# Altium schematic sheet USB2514 MCU.SchDoc: asdasdasd
size A4; DocumentNumber: 2; SheetNumber: 2; SheetTotal: 6
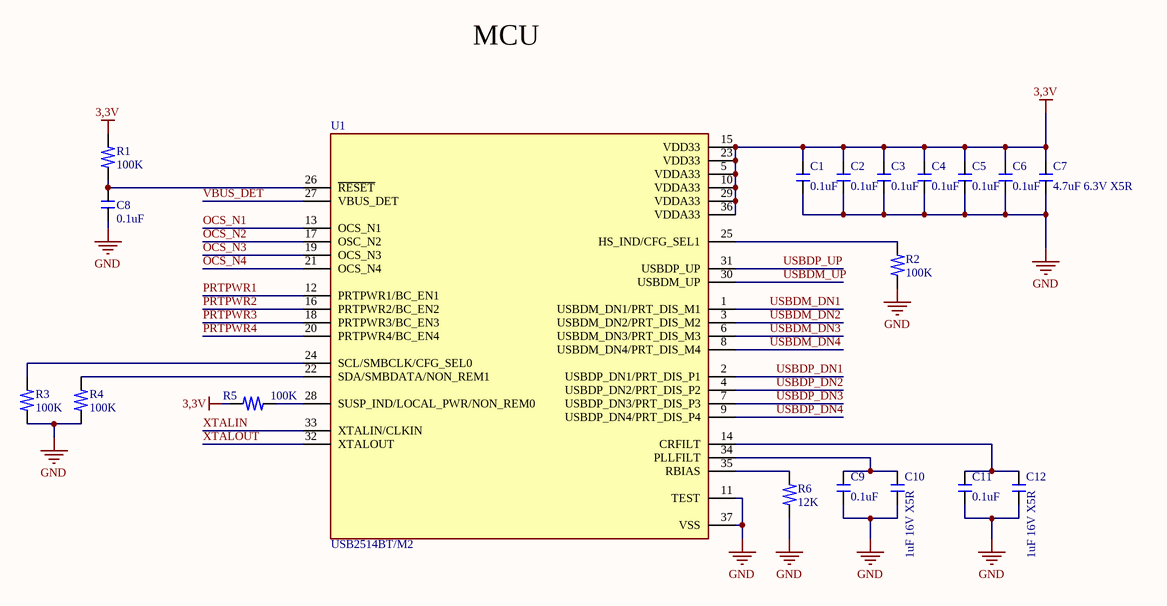
[diagram p0: USB2514 MCU.SchDoc]

## Parts
C1  0.1uF  [CAPC1608X06N-0603]
C2  0.1uF  [CAPC1608X06N-0603]
C3  0.1uF  [CAPC1608X06N-0603]
C4  0.1uF  [CAPC1608X06N-0603]
C5  0.1uF  [CAPC1608X06N-0603]
C6  0.1uF  [CAPC1608X06N-0603]
C7  4.7uF 6.3V X5R  [CAPC1608X06N-0603]
C8  0.1uF  [CAPC1608X06N-0603]
C9  0.1uF  [CAPC1608X06N-0603]
C10  1uF 16V X5R  [CAPC1608X06N-0603]
C11  0.1uF  [CAPC1608X06N-0603]
C12  1uF 16V X5R  [CAPC1608X06N-0603]
R1  100K  [RESC1608X06N-0603]
R2  100K  [RESC1608X06N-0603]
R3  100K  [RESC1608X06N-0603]
R4  100K  [RESC1608X06N-0603]
R5  100K  [RESC1608X06N-0603]
R6  12K  [RESC1608X06N-0603]
U1  USB2514BT/M2  [QFN50P600X600X100_HS-37N]

## Nets
3,3V: C1.2 C2.2 C3.2 C4.2 C5.2 C6.2 C7.2 R1.2 R5.2 U1.5(VDDA33) U1.10(VDDA33) U1.15(VDD33) U1.23(VDD33) U1.29(VDDA33) U1.36(VDDA33)
GND: C1.1 C2.1 C3.1 C4.1 C5.1 C6.1 C7.1 C8.1 C9.1 C10.1 C11.1 C12.1 R2.1 R3.1 R4.1 R6.1 U1.11(TEST) U1.37(VSS)
OCS_N1: U1.13(OCS_N1)
OCS_N2: U1.17(OSC_N2)
OCS_N3: U1.19(OCS_N3)
OCS_N4: U1.21(OCS_N4)
PRTPWR1: U1.12(PRTPWR1/BC_EN1)
PRTPWR2: U1.16(PRTPWR2/BC_EN2)
PRTPWR3: U1.18(PRTPWR3/BC_EN3)
PRTPWR4: U1.20(PRTPWR4/BC_EN4)
USBDM_DN1: U1.1(USBDM_DN1/PRT_DIS_M1)
USBDM_DN2: U1.3(USBDM_DN2/PRT_DIS_M2)
USBDM_DN3: U1.6(USBDM_DN3/PRT_DIS_M3)
USBDM_DN4: U1.8(USBDM_DN4/PRT_DIS_M4)
USBDM_UP: U1.30(USBDM_UP)
USBDP_DN1: U1.2(USBDP_DN1/PRT_DIS_P1)
USBDP_DN2: U1.4(USBDP_DN2/PRT_DIS_P2)
USBDP_DN3: U1.7(USBDP_DN3/PRT_DIS_P3)
USBDP_DN4: U1.9(USBDP_DN4/PRT_DIS_P4)
USBDP_UP: U1.31(USBDP_UP)
VBUS_DET: U1.27(VBUS_DET)
XTALIN: U1.33(XTALIN/CLKIN)
XTALOUT: U1.32(XTALOUT)
NetC8_2: C8.2 R1.1 U1.26(~{RESET})
NetC9_2: C9.2 C10.2 U1.34(PLLFILT)
NetC11_2: C11.2 C12.2 U1.14(CRFILT)
NetR2_2: R2.2 U1.25(HS_IND/CFG_SEL1)
NetR3_2: R3.2 U1.24(SCL/SMBCLK/CFG_SEL0)
NetR4_2: R4.2 U1.22(SDA/SMBDATA/NON_REM1)
NetR5_1: R5.1 U1.28(SUSP_IND/LOCAL_PWR/NON_REM0)
NetR6_2: R6.2 U1.35(RBIAS)

## Notes on the sheet
- MCU

## Library data of the parts
C1-C12 = CAP_0603_0.1uF
R1-R6 = RES_0603_10K
U1 = USB2514BT/M2: USB Hub Controller USB Interface 36-SQFN (6x6); MF: Microchip; Purchase-URL: https://pricing.snapeda.com/search/part/USB2514BT/M2/?ref=eda; Package: VFQFN-36 Microchip; MP: USB2514BT/M2; Check_prices: https://www.snapeda.com/parts/USB2514BT/M2/Microchip/view-part/1051251/?ref=eda; Price: None; SnapEDA_Link: https://www.snapeda.com/parts/USB2514BT/M2/Microchip/view-part/1051251/?ref=snap; Availability: Warning; Value: *